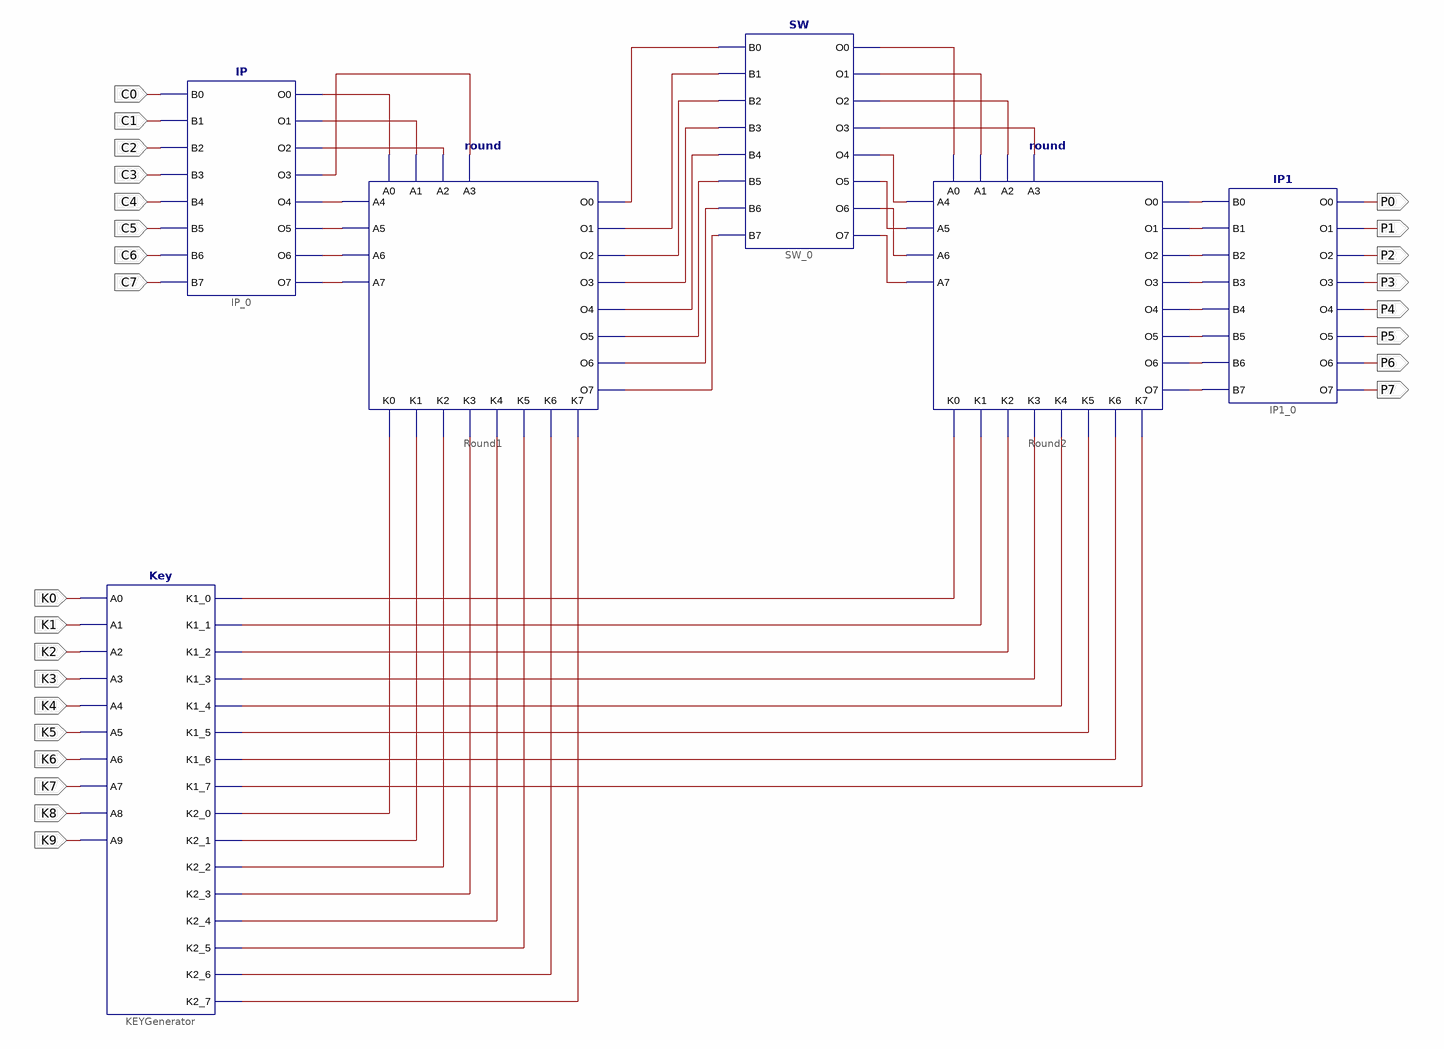
[diagram p0: schematic sheet 1]
// Xilinx ISE schematic Decrypt.sch (xc9500xl) as structural Verilog: 6 symbols, 26 ports
module Decrypt (
  input  K0,
  input  K1,
  input  K2,
  input  K3,
  input  K4,
  input  K5,
  input  K6,
  input  K7,
  input  K8,
  input  K9,
  input  C0,
  input  C1,
  input  C2,
  input  C3,
  input  C4,
  input  C5,
  input  C6,
  input  C7,
  output P0,
  output P1,
  output P2,
  output P3,
  output P4,
  output P5,
  output P6,
  output P7
);

  wire XLXN_17, XLXN_18, XLXN_19, XLXN_20, XLXN_66, XLXN_67, XLXN_68, XLXN_69, XLXN_70, XLXN_71, XLXN_72,
       XLXN_73, XLXN_126, XLXN_127, XLXN_128, XLXN_129, XLXN_130, XLXN_131, XLXN_132, XLXN_151, XLXN_152,
       XLXN_153, XLXN_155, XLXN_166, XLXN_239, XLXN_240, XLXN_241, XLXN_242, XLXN_243, XLXN_244, XLXN_245,
       XLXN_246, XLXN_247, XLXN_248, XLXN_249, XLXN_250, XLXN_251, XLXN_252, XLXN_253, XLXN_254, XLXN_255,
       XLXN_256, XLXN_257, XLXN_258, XLXN_259, XLXN_260, XLXN_261, XLXN_262;

  Key KEYGenerator (
    .A0(K0), .A1(K1), .A2(K2), .A3(K3), .A4(K4), .A5(K5), .A6(K6), .A7(K7), .A8(K8), .A9(K9),
    .K1_0(XLXN_262), .K1_1(XLXN_261), .K1_2(XLXN_260), .K1_3(XLXN_259), .K1_4(XLXN_258), .K1_5(XLXN_257),
    .K1_6(XLXN_256), .K1_7(XLXN_255), .K2_0(XLXN_247), .K2_1(XLXN_248), .K2_2(XLXN_249), .K2_3(XLXN_250),
    .K2_4(XLXN_251), .K2_5(XLXN_252), .K2_6(XLXN_253), .K2_7(XLXN_254));
  IP IP_0 (
    .B0(C0), .B1(C1), .B2(C2), .B3(C3), .B4(C4), .B5(C5), .B6(C6), .B7(C7), .O0(XLXN_151), .O1(XLXN_152),
    .O2(XLXN_153), .O3(XLXN_155), .O4(XLXN_17), .O5(XLXN_18), .O6(XLXN_19), .O7(XLXN_20));
  round Round1 (
    .A0(XLXN_151), .A1(XLXN_152), .A2(XLXN_153), .A3(XLXN_155), .A4(XLXN_17), .A5(XLXN_18), .A6(XLXN_19),
    .A7(XLXN_20), .K0(XLXN_247), .K1(XLXN_248), .K2(XLXN_249), .K3(XLXN_250), .K4(XLXN_251), .K5(XLXN_252),
    .K6(XLXN_253), .K7(XLXN_254), .O0(XLXN_166), .O1(XLXN_126), .O2(XLXN_127), .O3(XLXN_128), .O4(XLXN_129),
    .O5(XLXN_130), .O6(XLXN_131), .O7(XLXN_132));
  IP1 IP1_0 (
    .B0(XLXN_73), .B1(XLXN_72), .B2(XLXN_71), .B3(XLXN_70), .B4(XLXN_69), .B5(XLXN_68), .B6(XLXN_67),
    .B7(XLXN_66), .O0(P0), .O1(P1), .O2(P2), .O3(P3), .O4(P4), .O5(P5), .O6(P6), .O7(P7));
  round Round2 (
    .A0(XLXN_246), .A1(XLXN_245), .A2(XLXN_244), .A3(XLXN_243), .A4(XLXN_239), .A5(XLXN_240), .A6(XLXN_241),
    .A7(XLXN_242), .K0(XLXN_262), .K1(XLXN_261), .K2(XLXN_260), .K3(XLXN_259), .K4(XLXN_258), .K5(XLXN_257),
    .K6(XLXN_256), .K7(XLXN_255), .O0(XLXN_73), .O1(XLXN_72), .O2(XLXN_71), .O3(XLXN_70), .O4(XLXN_69),
    .O5(XLXN_68), .O6(XLXN_67), .O7(XLXN_66));
  SW SW_0 (
    .B0(XLXN_166), .B1(XLXN_126), .B2(XLXN_127), .B3(XLXN_128), .B4(XLXN_129), .B5(XLXN_130), .B6(XLXN_131),
    .B7(XLXN_132), .O0(XLXN_246), .O1(XLXN_245), .O2(XLXN_244), .O3(XLXN_243), .O4(XLXN_239), .O5(XLXN_240),
    .O6(XLXN_241), .O7(XLXN_242));
endmodule
